# EAGLE schematic P32 Main (EAGLE 5.06)
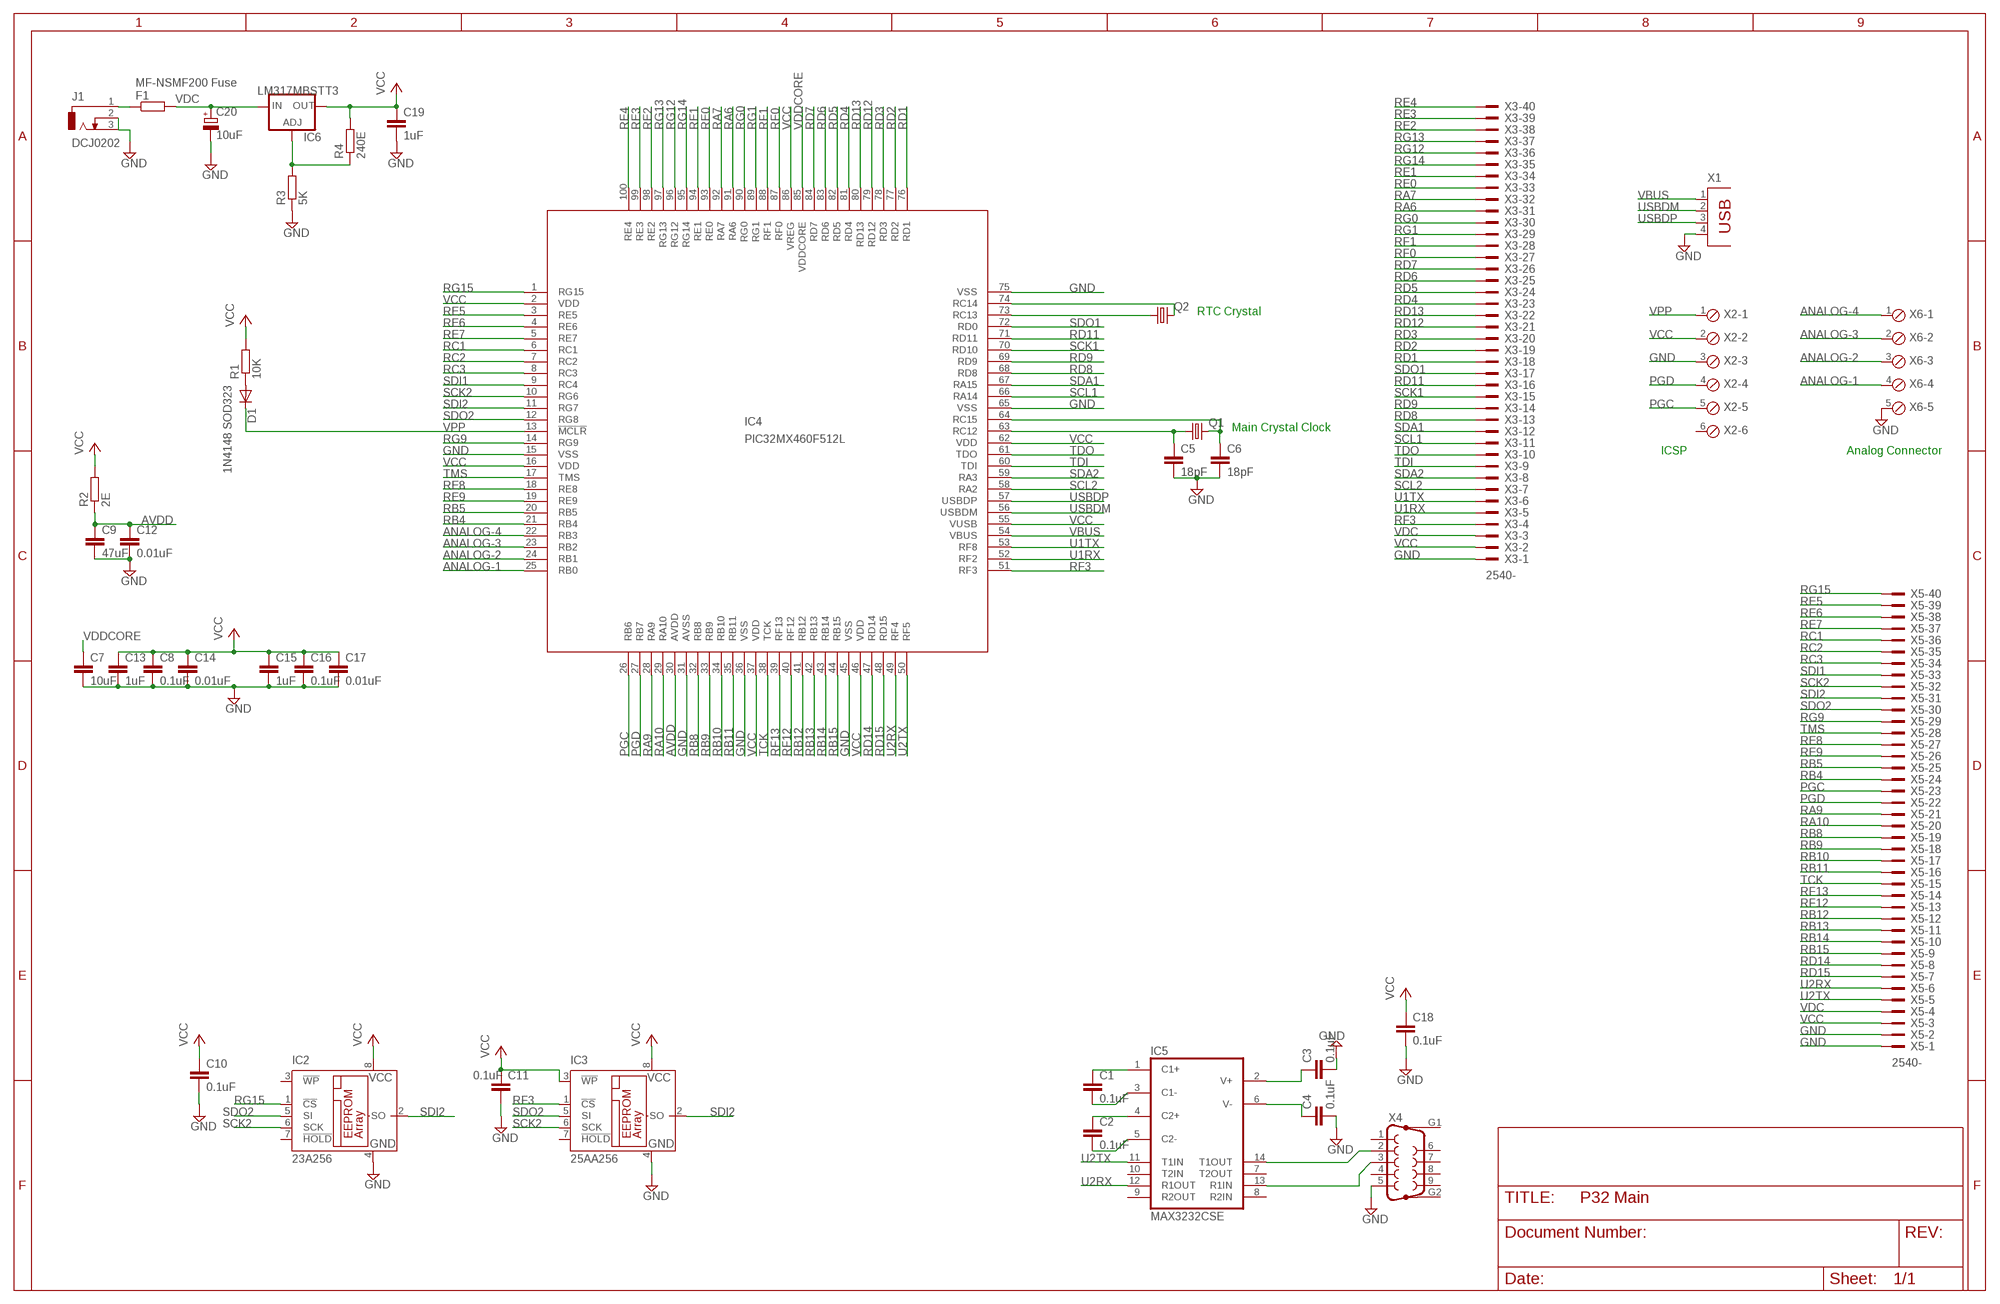
[diagram p0: schematic, sheet 1]

## Parts
C1  0.1uF  C-EUC0805  [C0805]
C2  0.1uF  C-EUC0805  [C0805]
C3  0.1uF  C-EUC0805  [C0805]
C4  0.1uF  C-EUC0805  [C0805]
C5  18pF  C-EUC0805  [C0805]
C6  18pF  C-EUC0805  [C0805]
C7  10uF  C-EUC0805  [C0805]
C8  0.1uF  C-EUC0805  [C0805]
C9  47uF  C-EUC1206  [C1206]
C10  0.1uF  C-EUC0805  [C0805]
C11  0.1uF  C-EUC0805  [C0805]
C12  0.01uF  C-EUC0805  [C0805]
C13  1uF  C-EUC0805  [C0805]
C14  0.01uF  C-EUC0805  [C0805]
C15  1uF  C-EUC0805  [C0805]
C16  0.1uF  C-EUC0805  [C0805]
C17  0.01uF  C-EUC0805  [C0805]
C18  0.1uF  C-EUC0805  [C0805]
C19  1uF  C-EUC0805  [C0805]
C20  10uF  CPOL-EUSMCB  [SMC_B]
D1  1N4148 SOD323  DIODE-SOD323-R  [SOD323-R]
F1  MF-NSMF200 Fuse  R-EU_R1206  [R1206]
IC2  23A256  25AA080SN  [SO-08]
IC3  25AA256  25AA080SN  [SO-08]
IC4  PIC32MX460F512L  [UBW32_TQFP100]
IC5  MAX3232CSE  [SO16]
IC6  LM317MBSTT3  [SOT223]
J1  DCJ0202  [DCJ0202]
Q1  CRYSTALHC49S  [HC49/S]
Q2  CRYSTALTC26V  [TC26V]
R1  10K  R-EU_R0805  [R0805]
R2  2E  R-EU_R0805  [R0805]
R3  5K  R-EU_R0805  [R0805]
R4  240E  R-EU_R0805  [R0805]
X1  PN61729  [PN61729]
X2  MPT6  [6POL254]
X3  2540-  [PAK100/2500-40]
X4  F09HP  [F09HP]
X5  2540-  [PAK100/2500-40]
X6  MPT5  [5POL254]

## Nets
ANALOG-1: IC4.25(RB0) X6.4
ANALOG-2: IC4.24(RB1) X6.3
ANALOG-3: IC4.23(RB2) X6.2
ANALOG-4: IC4.22(RB3) X6.1
AVDD: C9.1 C12.1 IC4.30(AVDD) R2.1
GND: C3.2 C4.2 C5.2 C6.2 C7.2 C8.2 C9.2 C10.2 C11.2 C12.2 C13.2 C14.2 C15.2 C16.2 C17.2 C18.2 C19.2 C20.- IC2.4(GND) IC3.4(GND) IC4.15(VSS) IC4.31(AVSS) IC4.36(VSS) IC4.45(VSS) IC4.65(VSS) IC4.75(VSS) J1.2 J1.3 R3.1 X1.4 X2.3 X3.1 X4.5 X5.1 X5.2 X6.5
N$1: D1.A R1.1
N$2: C3.1 IC5.2(V+)
N$5: C4.1 IC5.6(V-)
N$6: C1.1 IC5.1(C1+)
N$7: C1.2 IC5.3(C1-)
N$9: C2.1 IC5.4(C2+)
N$10: C2.2 IC5.5(C2-)
N$12: IC6.1(ADJ) R3.2 R4.1
N$13: IC5.14(T1OUT) X4.2
N$14: IC5.13(R1IN) X4.3
N$17: F1.1 J1.1
N$90: IC4.74(RC14) Q2.2
N$91: IC4.73(RC13) Q2.1
N$100: C6.1 IC4.64(RC15) Q1.2
N$101: C5.1 IC4.63(RC12) Q1.1
PGC: IC4.26(RB6) X2.5 X5.23
PGD: IC4.27(RB7) X2.4 X5.22
RA6: IC4.91(RA6) X3.31
RA7: IC4.92(RA7) X3.32
RA9: IC4.28(RA9) X5.21
RA10: IC4.29(RA10) X5.20
RB4: IC4.21(RB4) X5.24
RB5: IC4.20(RB5) X5.25
RB8: IC4.32(RB8) X5.19
RB9: IC4.33(RB9) X5.18
RB10: IC4.34(RB10) X5.17
RB11: IC4.35(RB11) X5.16
RB12: IC4.41(RB12) X5.12
RB13: IC4.42(RB13) X5.11
RB14: IC4.43(RB14) X5.10
RB15: IC4.44(RB15) X5.9
RC1: IC4.6(RC1) X5.36
RC2: IC4.7(RC2) X5.35
RC3: IC4.8(RC3) X5.34
RD1: IC4.76(RD1) X3.18
RD2: IC4.77(RD2) X3.19
RD3: IC4.78(RD3) X3.20
RD4: IC4.81(RD4) X3.23
RD5: IC4.82(RD5) X3.24
RD6: IC4.83(RD6) X3.25
RD7: IC4.84(RD7) X3.26
RD8: IC4.68(RD8) X3.13
RD9: IC4.69(RD9) X3.14
RD11: IC4.71(RD11) X3.16
RD12: IC4.79(RD12) X3.21
RD13: IC4.80(RD13) X3.22
RD14: IC4.47(RD14) X5.8
RD15: IC4.48(RD15) X5.7
RE0: IC4.93(RE0) X3.33
RE1: IC4.94(RE1) X3.34
RE2: IC4.98(RE2) X3.38
RE3: IC4.99(RE3) X3.39
RE4: IC4.100(RE4) X3.40
RE5: IC4.3(RE5) X5.39
RE6: IC4.4(RE6) X5.38
RE7: IC4.5(RE7) X5.37
RE8: IC4.18(RE8) X5.27
RE9: IC4.19(RE9) X5.26
RF0: IC4.87(RF0) X3.27
RF1: IC4.88(RF1) X3.28
RF3: IC3.1(!CS) IC4.51(RF3) X3.4
RF12: IC4.40(RF12) X5.13
RF13: IC4.39(RF13) X5.14
RG0: IC4.90(RG0) X3.30
RG1: IC4.89(RG1) X3.29
RG9: IC4.14(RG9) X5.29
RG12: IC4.96(RG12) X3.36
RG13: IC4.97(RG13) X3.37
RG14: IC4.95(RG14) X3.35
RG15: IC2.1(!CS) IC4.1(RG15) X5.40
SCK1: IC4.70(RD10) X3.15
SCK2: IC2.6(SCK) IC3.6(SCK) IC4.10(RG6) X5.32
SCL1: IC4.66(RA14) X3.11
SCL2: IC4.58(RA2) X3.7
SDA1: IC4.67(RA15) X3.12
SDA2: IC4.59(RA3) X3.8
SDI1: IC4.9(RC4) X5.33
SDI2: IC2.2(SO) IC3.2(SO) IC4.11(RG7) X5.31
SDO1: IC4.72(RD0) X3.17
SDO2: IC2.5(SI) IC3.5(SI) IC4.12(RG8) X5.30
TCK: IC4.38(TCK) X5.15
TDI: IC4.60(TDI) X3.9
TDO: IC4.61(TDO) X3.10
TMS: IC4.17(TMS) X5.28
U1RX: IC4.52(RF2) X3.5
U1TX: IC4.53(RF8) X3.6
U2RX: IC4.49(RF4) IC5.12(R1OUT) X5.6
U2TX: IC4.50(RF5) IC5.11(T1IN) X5.5
USBDM: IC4.56(USBDM) X1.2
USBDP: IC4.57(USBDP) X1.3
VBUS: IC4.54(VBUS) X1.1
VCC: C8.1 C10.1 C11.1 C13.1 C14.1 C15.1 C16.1 C17.1 C18.1 C19.1 IC2.8(VCC) IC3.3(!WP) IC3.8(VCC) IC4.2(VDD) IC4.16(VDD) IC4.37(VDD) IC4.46(VDD) IC4.55(VUSB) IC4.62(VDD) IC4.86(VREG) IC6.4(OUT) R1.2 R2.2 R4.2 X2.2 X3.2 X5.3
VDC: C20.+ F1.2 IC6.3(IN) X3.3 X5.4
VDDCORE: C7.1 IC4.85(VDDCORE)
VPP: D1.C IC4.13(!MCLR) X2.1
Unconnected: IC2.3(!WP) IC2.7(!HOLD) IC3.7(!HOLD) IC5.7(T2OUT) IC5.8(R2IN) IC5.9(R2OUT) IC5.10(T2IN) X2.6 X4.1 X4.4 X4.6 X4.7 X4.8 X4.9 X4.G1 X4.G2

## Notes on the sheet
- RTC Crystal
- Main Crystal Clock
- ICSP | Analog Connector

## Power pins joined to a net without a drawn wire
GND: IC5.15(GND)
VCC: IC5.16(VCC)

## Library data of the parts
C1-C19 = rcl:C-EU: CAPACITOR, European symbol
C20 = rcl:CPOL-EU: POLARIZED CAPACITOR, European symbol
D1 = diode:DIODE-: DIODE
F1 R1-R4 = rcl:R-EU_: RESISTOR, European symbol
IC2 IC3 = microchip:25*: Serial EEPROM 4 K, SPI bus
IC4 = microchip:PIC32MX460F512L: PIC32MX460F512L edit this description Auto generated by make-symbol-device-package-bsdl.ulp Rev. 25 Source: PIC32MX460F512L.bsdl
IC5 = maxim:MAX3232*: True RS-232 Transceivers 3.0V to 5.5V, Low-Power up to 1Mbps, Using Four 0.1µF External Capacitors Source: http://pdfserv.maxim-ic.com/en/ds/MAX3222-MAX3241.pdf
IC6 = v-reg:LM317?*: 500 mA Adjustable Output Positive Voltage Regulator Source: http://www.onsemi.co.jp .. LM317M-D.PDF
J1 = con-jack:DCJ0202: DC POWER JACK Source: DCJ0202.pdf
Q1 Q2 = crystal:CRYSTAL: CRYSTAL
X1 = con-berg:PN61729: BERG USB connector
X2 = con-phoenix-254:MPT6: PHOENIX CONNECTOR
X3 X5 = con-3m:2540-: 3M (TM) Pak 100 4-Wall Header Source: 3M
X4 = con-subd:F09HP: SUB-D
X6 = con-phoenix-254:MPT5: PHOENIX CONNECTOR